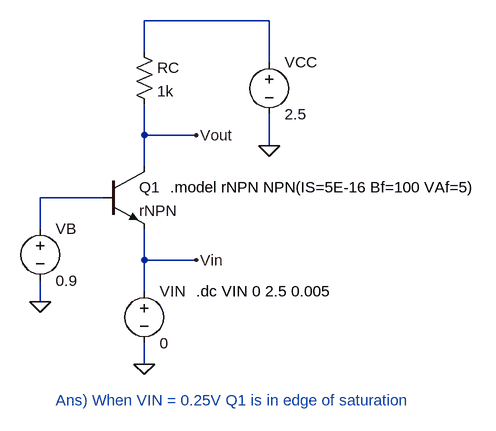
[diagram p0: schematic 4_57.asc]
4_57.asc, the LTspice schematic file:
Version 4
SHEET 1 880 680
WIRE 336 -96 144 -96
WIRE 144 -48 144 -96
WIRE 336 -32 336 -96
WIRE 144 80 144 32
WIRE 224 80 144 80
WIRE 336 96 336 48
WIRE 144 128 144 80
WIRE 80 176 -16 176
WIRE -16 224 -16 176
WIRE 144 272 144 224
WIRE 224 272 144 272
WIRE 144 320 144 272
WIRE -16 336 -16 304
WIRE 144 432 144 400
FLAG -16 336 0
FLAG 336 96 0
FLAG 224 80 Vout
FLAG 224 272 Vin
FLAG 144 432 0
SYMBOL npn 80 128 R0
SYMATTR InstName Q1
SYMATTR Value rNPN
SYMBOL voltage -16 208 R0
SYMATTR InstName VB
SYMATTR Value 0.9
SYMBOL voltage 336 -48 R0
SYMATTR InstName VCC
SYMATTR Value 2.5
SYMBOL res 128 -64 R0
SYMATTR InstName RC
SYMATTR Value 1k
SYMBOL voltage 144 304 R0
SYMATTR InstName VIN
SYMATTR Value 0
TEXT 184 160 Left 2 !.model rNPN NPN(IS=5E-16 Bf=100 VAf=5)
TEXT 224 320 Left 2 !.dc VIN 0 2.5 0.005
TEXT 8 488 Left 2 ;Ans) When VIN = 0.25V Q1 is in edge of saturation

The netlist it stands for:
* 4_57.asc
Q1 Vout N002 Vin 0 rNPN
VB N002 0 0.9
VCC N001 0 2.5
RC N001 Vout 1k
VIN Vin 0 0
.model NPN NPN
.model PNP PNP
.lib standard.bjt
.model rNPN NPN(IS=5E-16 Bf=100 VAf=5)
.dc VIN 0 2.5 0.005
* Ans) When VIN = 0.25V Q1 is in edge of saturation
.backanno
.end

* Results of the author's LTspice run, read from the files saved beside the schematic
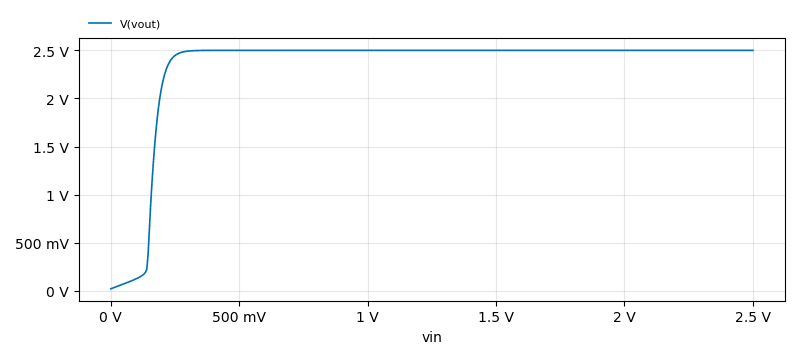
[diagram p1: DC transfer characteristic of 4_57.asc, plotted from the saved traces]
* DC transfer characteristic, 1 run:
*   V(vout): 20.67 mV at vin=0 V, 2.5 V at vin=2.5 V, min 20.67 mV, max 2.5 V